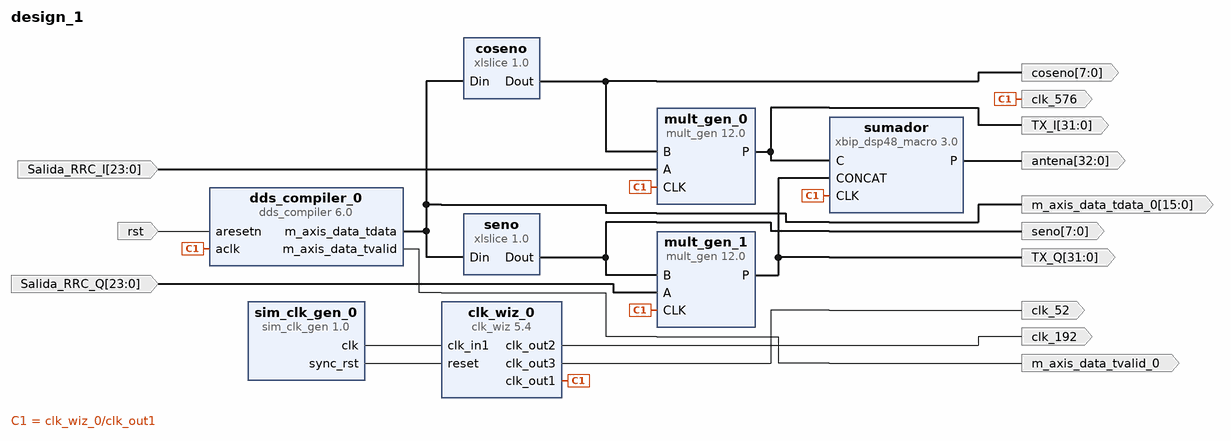
[diagram p0: block diagram of the top level]
# Vivado block design design_1, xc7k160tifbg676-2L, Vivado 2017.4
create_bd_design design_1

create_bd_port -dir I -type rst rst
create_bd_port -dir I -from 23 -to 0 -type data Salida_RRC_I
create_bd_port -dir I -from 23 -to 0 -type data Salida_RRC_Q
create_bd_port -dir O -from 31 -to 0 -type data TX_I
create_bd_port -dir O -from 31 -to 0 -type data TX_Q
create_bd_port -dir O -from 15 -to 0 m_axis_data_tdata_0
create_bd_port -dir O m_axis_data_tvalid_0
create_bd_port -dir O -from 7 -to 0 seno
create_bd_port -dir O -from 7 -to 0 coseno
create_bd_port -dir O -from 32 -to 0 -type data antena
create_bd_port -dir O -type clk clk_576
set_property -dict {CONFIG.FREQ_HZ 576000000} [get_bd_ports clk_576]
create_bd_port -dir O -type clk clk_192
set_property -dict {CONFIG.FREQ_HZ 192000000} [get_bd_ports clk_192]
create_bd_port -dir O -type clk clk_52
set_property -dict {CONFIG.FREQ_HZ 52363636} [get_bd_ports clk_52]

create_bd_cell -type ip -vlnv xilinx.com:ip:dds_compiler:6.0 dds_compiler_0
set_property -dict [list \
  CONFIG.PartsPresent Phase_Generator_and_SIN_COS_LUT \
  CONFIG.DDS_Clock_Rate 576 \
  CONFIG.Channels 1 \
  CONFIG.Parameter_Entry System_Parameters \
  CONFIG.Frequency_Resolution 1 \
  CONFIG.Noise_Shaping Auto \
  CONFIG.Phase_Width 30 \
  CONFIG.Output_Width 8 \
  CONFIG.Phase_Increment Fixed \
  CONFIG.Phase_offset None \
  CONFIG.Output_Selection Sine_and_Cosine \
  CONFIG.Negative_Sine true \
  CONFIG.Has_Phase_Out false \
  CONFIG.DATA_Has_TLAST Not_Required \
  CONFIG.Has_TREADY false \
  CONFIG.S_PHASE_Has_TUSER Not_Required \
  CONFIG.M_DATA_Has_TUSER Not_Required \
  CONFIG.M_PHASE_Has_TUSER Not_Required \
  CONFIG.Latency 5 \
  CONFIG.Has_ARESETn true \
  CONFIG.Output_Frequency1 100 \
  CONFIG.PINC1 1011000111000111000111000111 \
  CONFIG.Phase_Offset_Angles1 0 \
  CONFIG.POFF1 0 \
  CONFIG.Output_Frequency2 0 \
  CONFIG.PINC2 0 \
] [get_bd_cells dds_compiler_0]
create_bd_cell -type ip -vlnv xilinx.com:ip:xlslice:1.0 seno
set_property -dict {CONFIG.DIN_TO 8 CONFIG.DIN_FROM 15 CONFIG.DIN_WIDTH 16 CONFIG.DOUT_WIDTH 8} [get_bd_cells seno]
create_bd_cell -type ip -vlnv xilinx.com:ip:xlslice:1.0 coseno
set_property -dict {CONFIG.DIN_TO 0 CONFIG.DIN_FROM 7 CONFIG.DIN_WIDTH 16 CONFIG.DOUT_WIDTH 8} [get_bd_cells coseno]
create_bd_cell -type ip -vlnv xilinx.com:ip:xbip_dsp48_macro:3.0 sumador
set_property -dict [list \
  CONFIG.instruction1 C+CONCAT \
  CONFIG.areg_1 false \
  CONFIG.areg_2 false \
  CONFIG.areg_3 false \
  CONFIG.areg_4 false \
  CONFIG.breg_3 false \
  CONFIG.breg_4 false \
  CONFIG.creg_1 false \
  CONFIG.creg_2 false \
  CONFIG.creg_3 true \
  CONFIG.creg_4 true \
  CONFIG.creg_5 true \
  CONFIG.concatreg_3 true \
  CONFIG.concatreg_4 true \
  CONFIG.concatreg_5 true \
  CONFIG.mreg_5 false \
  CONFIG.preg_6 true \
  CONFIG.concat_width 32 \
  CONFIG.c_width 32 \
  CONFIG.p_full_width 33 \
  CONFIG.p_width 33 \
  CONFIG.p_binarywidth 0 \
] [get_bd_cells sumador]
create_bd_cell -type ip -vlnv xilinx.com:ip:mult_gen:12.0 mult_gen_0
set_property -dict {CONFIG.PortAWidth 24 CONFIG.PortBWidth 8} [get_bd_cells mult_gen_0]
create_bd_cell -type ip -vlnv xilinx.com:ip:mult_gen:12.0 mult_gen_1
set_property -dict {CONFIG.PortAWidth 24 CONFIG.PortBWidth 8} [get_bd_cells mult_gen_1]
create_bd_cell -type ip -vlnv xilinx.com:ip:clk_wiz:5.4 clk_wiz_0
set_property -dict [list \
  CONFIG.PRIM_IN_FREQ 36 \
  CONFIG.CLKIN1_JITTER_PS 277.77 \
  CONFIG.CLKOUT2_USED true \
  CONFIG.CLKOUT3_USED true \
  CONFIG.NUM_OUT_CLKS 3 \
  CONFIG.CLKOUT1_REQUESTED_OUT_FREQ 576.000 \
  CONFIG.CLKOUT2_REQUESTED_OUT_FREQ 192.000 \
  CONFIG.CLKOUT3_REQUESTED_OUT_FREQ 52.000 \
  CONFIG.USE_LOCKED false \
  CONFIG.MMCM_DIVCLK_DIVIDE 1 \
  CONFIG.MMCM_CLKFBOUT_MULT_F 32.000 \
  CONFIG.MMCM_CLKIN1_PERIOD 27.778 \
  CONFIG.MMCM_CLKIN2_PERIOD 10.0 \
  CONFIG.MMCM_CLKOUT0_DIVIDE_F 2.000 \
  CONFIG.MMCM_CLKOUT1_DIVIDE 6 \
  CONFIG.MMCM_CLKOUT2_DIVIDE 22 \
  CONFIG.CLKOUT1_JITTER 129.300 \
  CONFIG.CLKOUT1_PHASE_ERROR 173.591 \
  CONFIG.CLKOUT2_JITTER 151.084 \
  CONFIG.CLKOUT2_PHASE_ERROR 173.591 \
  CONFIG.CLKOUT3_JITTER 193.692 \
  CONFIG.CLKOUT3_PHASE_ERROR 173.591 \
] [get_bd_cells clk_wiz_0]
create_bd_cell -type ip -vlnv xilinx.com:ip:sim_clk_gen:1.0 sim_clk_gen_0
set_property -dict {CONFIG.RESET_POLARITY ACTIVE_HIGH CONFIG.FREQ_HZ 36000000} [get_bd_cells sim_clk_gen_0]

# ---- connections ----

connect_bd_net -net aresetn_0_1 [get_bd_ports rst] [get_bd_pins dds_compiler_0/aresetn]
connect_bd_net -net A_0_1 [get_bd_ports Salida_RRC_I] [get_bd_pins mult_gen_0/A]
connect_bd_net -net A_0_2 [get_bd_ports Salida_RRC_Q] [get_bd_pins mult_gen_1/A]
connect_bd_net -net xbip_dsp48_macro_0_P [get_bd_pins mult_gen_0/P] [get_bd_ports TX_I] [get_bd_pins sumador/C]
connect_bd_net -net xbip_dsp48_macro_1_P [get_bd_pins mult_gen_1/P] [get_bd_ports TX_Q] [get_bd_pins sumador/CONCAT]
connect_bd_net [get_bd_pins dds_compiler_0/m_axis_data_tdata] [get_bd_ports m_axis_data_tdata_0] [get_bd_pins coseno/Din] [get_bd_pins seno/Din]
connect_bd_net [get_bd_pins dds_compiler_0/m_axis_data_tvalid] [get_bd_ports m_axis_data_tvalid_0]
connect_bd_net [get_bd_pins seno/Dout] [get_bd_ports seno] [get_bd_pins mult_gen_1/B]
connect_bd_net [get_bd_pins coseno/Dout] [get_bd_ports coseno] [get_bd_pins mult_gen_0/B]
connect_bd_net [get_bd_pins sumador/P] [get_bd_ports antena]
connect_bd_net [get_bd_pins sim_clk_gen_0/clk] [get_bd_pins clk_wiz_0/clk_in1]
connect_bd_net [get_bd_pins sim_clk_gen_0/sync_rst] [get_bd_pins clk_wiz_0/reset]
connect_bd_net [get_bd_pins clk_wiz_0/clk_out1] \
  [get_bd_ports clk_576] [get_bd_pins dds_compiler_0/aclk] [get_bd_pins sumador/CLK] [get_bd_pins mult_gen_0/CLK] \
  [get_bd_pins mult_gen_1/CLK]
connect_bd_net [get_bd_pins clk_wiz_0/clk_out2] [get_bd_ports clk_192]
connect_bd_net [get_bd_pins clk_wiz_0/clk_out3] [get_bd_ports clk_52]

validate_bd_design
save_bd_design
